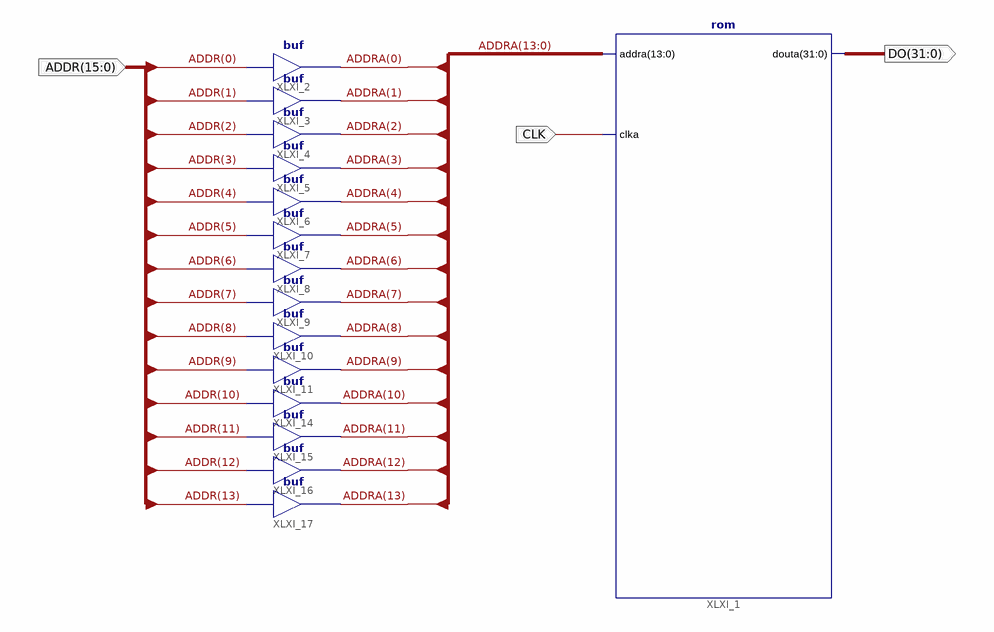
[diagram p0: schematic sheet 1]
// Xilinx ISE schematic rom_wrapper.sch (spartan6) as structural Verilog: 15 symbols, 3 ports
module rom_wrapper (
  input  [15:0] ADDR,
  input  CLK,
  output [31:0] DO
);

  wire [13:0] ADDRA;

  rom XLXI_1 (.addra(ADDRA), .clka(CLK), .douta(DO));
  buf XLXI_2 (ADDRA[0], ADDR[0]);
  buf XLXI_3 (ADDRA[1], ADDR[1]);
  buf XLXI_4 (ADDRA[2], ADDR[2]);
  buf XLXI_5 (ADDRA[3], ADDR[3]);
  buf XLXI_6 (ADDRA[4], ADDR[4]);
  buf XLXI_7 (ADDRA[5], ADDR[5]);
  buf XLXI_8 (ADDRA[6], ADDR[6]);
  buf XLXI_9 (ADDRA[7], ADDR[7]);
  buf XLXI_10 (ADDRA[8], ADDR[8]);
  buf XLXI_11 (ADDRA[9], ADDR[9]);
  buf XLXI_14 (ADDRA[10], ADDR[10]);
  buf XLXI_15 (ADDRA[11], ADDR[11]);
  buf XLXI_16 (ADDRA[12], ADDR[12]);
  buf XLXI_17 (ADDRA[13], ADDR[13]);
endmodule
